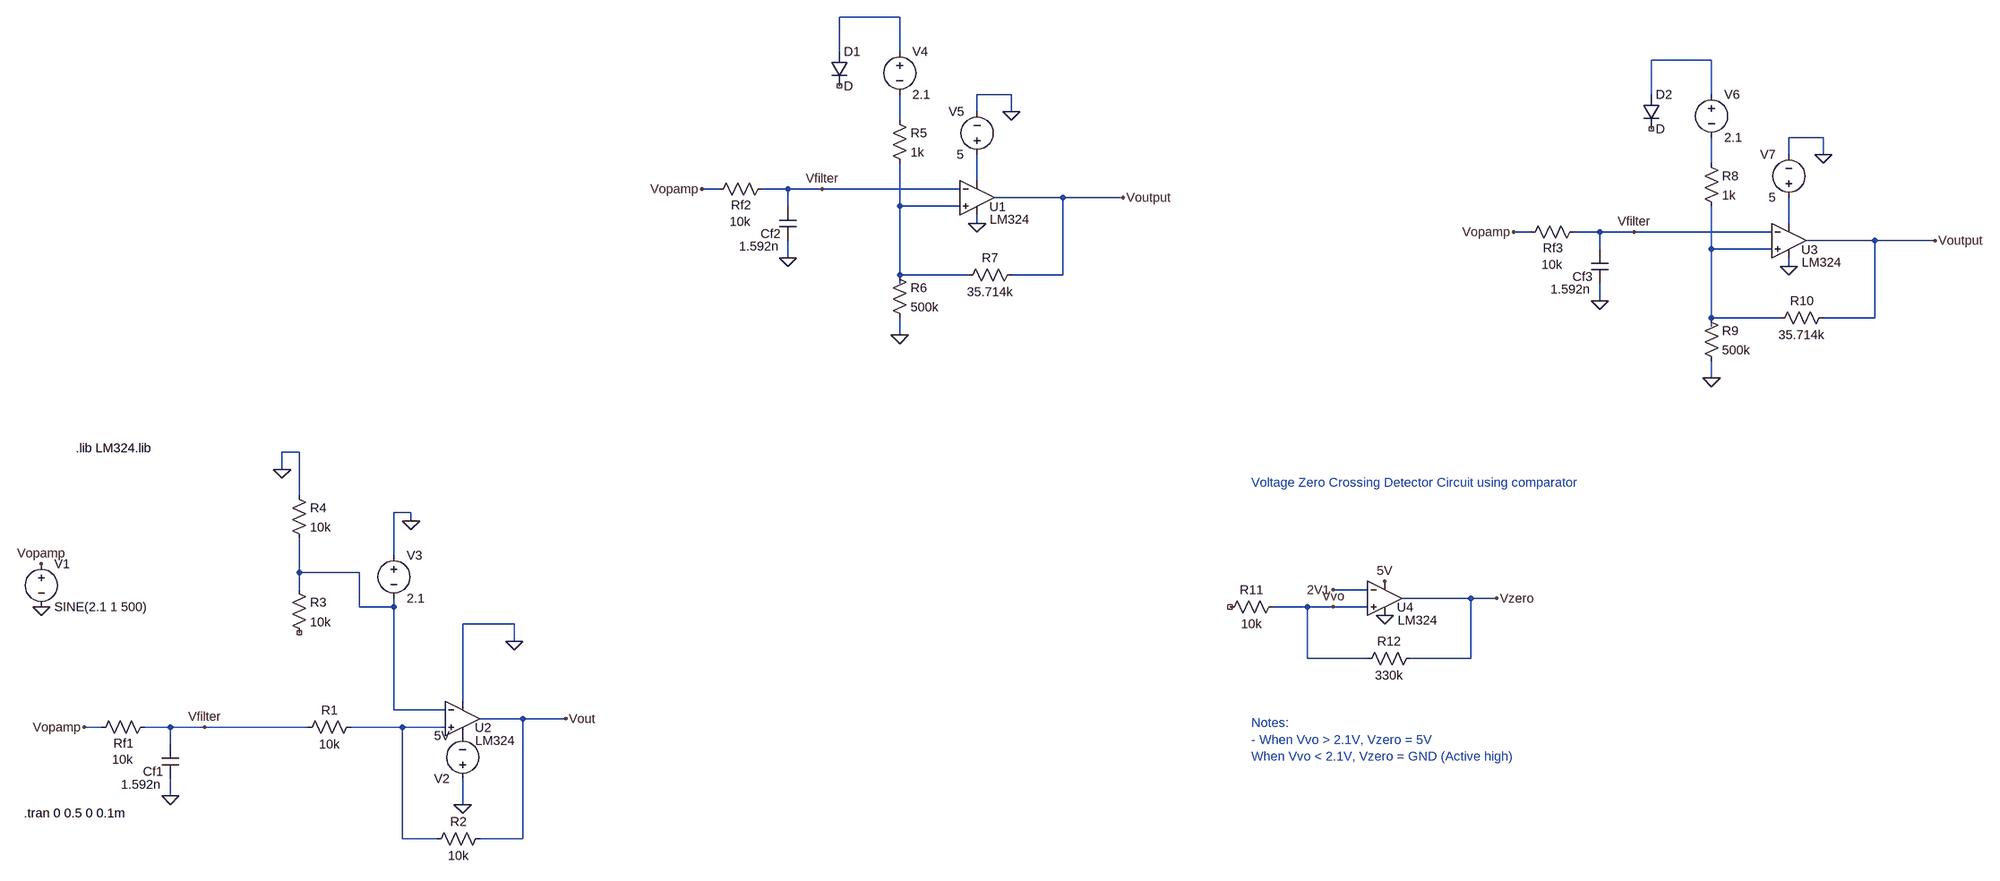
[diagram p0: schematic Comparator.asc]
Comparator.asc, the LTspice schematic file:
Version 4
SHEET 1 4332 680
WIRE 2144 -1360 2032 -1360
WIRE 2032 -1296 2032 -1360
WIRE 2144 -1296 2144 -1360
WIRE 3808 -1280 3696 -1280
WIRE 2352 -1216 2288 -1216
WIRE 3696 -1216 3696 -1280
WIRE 3808 -1216 3808 -1280
WIRE 2288 -1184 2288 -1216
WIRE 2352 -1184 2352 -1216
WIRE 2144 -1168 2144 -1216
WIRE 4016 -1136 3952 -1136
WIRE 3952 -1104 3952 -1136
WIRE 4016 -1104 4016 -1136
WIRE 3808 -1088 3808 -1136
WIRE 2288 -1056 2288 -1104
WIRE 1808 -1040 1776 -1040
WIRE 1936 -1040 1888 -1040
WIRE 2000 -1040 1936 -1040
WIRE 2256 -1040 2000 -1040
WIRE 2448 -1024 2320 -1024
WIRE 2560 -1024 2448 -1024
WIRE 1936 -1008 1936 -1040
WIRE 2144 -1008 2144 -1088
WIRE 2256 -1008 2144 -1008
WIRE 2288 -976 2288 -992
WIRE 3952 -976 3952 -1024
WIRE 3472 -960 3440 -960
WIRE 3600 -960 3552 -960
WIRE 3664 -960 3600 -960
WIRE 3920 -960 3664 -960
WIRE 4112 -944 3984 -944
WIRE 4224 -944 4112 -944
WIRE 3600 -928 3600 -960
WIRE 3808 -928 3808 -1008
WIRE 3920 -928 3808 -928
WIRE 1936 -912 1936 -944
WIRE 3952 -896 3952 -912
WIRE 2144 -880 2144 -1008
WIRE 2272 -880 2144 -880
WIRE 2448 -880 2448 -1024
WIRE 2448 -880 2352 -880
WIRE 2144 -864 2144 -880
WIRE 3600 -832 3600 -864
WIRE 3808 -800 3808 -928
WIRE 3936 -800 3808 -800
WIRE 4112 -800 4112 -944
WIRE 4112 -800 4016 -800
WIRE 3808 -784 3808 -800
WIRE 2144 -768 2144 -800
WIRE 3808 -688 3808 -720
WIRE 560 -448 528 -448
WIRE 528 -416 528 -448
WIRE 560 -368 560 -448
WIRE 768 -336 736 -336
WIRE 768 -320 768 -336
WIRE 736 -256 736 -336
WIRE 560 -224 560 -288
WIRE 672 -224 560 -224
WIRE 560 -192 560 -224
WIRE 3168 -192 3104 -192
WIRE 3360 -176 3232 -176
WIRE 3408 -176 3360 -176
WIRE 672 -160 672 -224
WIRE 736 -160 736 -176
WIRE 736 -160 672 -160
WIRE 3056 -160 2992 -160
WIRE 3104 -160 3056 -160
WIRE 3168 -160 3104 -160
WIRE 960 -128 864 -128
WIRE 960 -96 960 -128
WIRE 3056 -64 3056 -160
WIRE 3168 -64 3056 -64
WIRE 3360 -64 3360 -176
WIRE 3360 -64 3248 -64
WIRE 864 16 864 -128
WIRE 736 32 736 -160
WIRE 832 32 736 32
WIRE 976 48 896 48
WIRE 1056 48 976 48
WIRE 192 64 160 64
WIRE 320 64 272 64
WIRE 384 64 320 64
WIRE 576 64 384 64
WIRE 752 64 656 64
WIRE 832 64 752 64
WIRE 320 96 320 64
WIRE 320 192 320 160
WIRE 864 208 864 160
WIRE 752 272 752 64
WIRE 816 272 752 272
WIRE 976 272 976 48
WIRE 976 272 896 272
FLAG 320 192 0
FLAG 160 64 Vopamp
FLAG 384 64 Vfilter
FLAG 80 -160 0
FLAG 80 -240 Vopamp
FLAG 864 208 0
FLAG 960 -96 0
FLAG 768 -320 0
FLAG 1056 48 Vout
FLAG 528 -416 0
FLAG 1936 -912 0
FLAG 1776 -1040 Vopamp
FLAG 2000 -1040 Vfilter
FLAG 2144 -768 0
FLAG 2288 -976 0
FLAG 2352 -1184 0
FLAG 2560 -1024 Voutput
FLAG 3600 -832 0
FLAG 3440 -960 Vopamp
FLAG 3664 -960 Vfilter
FLAG 3808 -688 0
FLAG 3952 -896 0
FLAG 4016 -1104 0
FLAG 4224 -944 Voutput
FLAG 3200 -208 5V
FLAG 3200 -144 0
FLAG 3408 -176 Vzero
FLAG 3104 -192 2V1
FLAG 3104 -160 Vvo
SYMBOL res 288 48 R90
WINDOW 0 62 55 VBottom 2
WINDOW 3 61 57 VTop 2
SYMATTR InstName Rf1
SYMATTR Value 10k
SYMBOL cap 336 160 R180
WINDOW 0 29 13 Left 2
WINDOW 3 33 -11 Left 2
SYMATTR InstName Cf1
SYMATTR Value 1.592n
SYMBOL voltage 80 -256 R0
WINDOW 39 0 0 Left 0
SYMATTR InstName V1
SYMATTR Value SINE(2.1 1 500)
SYMATTR Value2 AC 1 0
SYMBOL res 672 48 R90
WINDOW 0 0 56 VBottom 2
WINDOW 3 32 56 VTop 2
SYMATTR InstName R1
SYMATTR Value 10k
SYMBOL res 912 256 R90
WINDOW 0 0 56 VBottom 2
WINDOW 3 32 56 VTop 2
SYMATTR InstName R2
SYMATTR Value 10k
SYMBOL voltage 864 176 R180
WINDOW 123 0 0 Left 0
WINDOW 39 0 0 Left 0
SYMATTR InstName V2
SYMATTR Value 5V
SYMBOL voltage 736 -272 R0
WINDOW 123 0 0 Left 0
WINDOW 39 0 0 Left 0
SYMATTR InstName V3
SYMATTR Value 2.1
SYMBOL Opamps/opamp2 864 -16 R0
WINDOW 0 23 81 Left 2
WINDOW 3 24 105 Left 2
SYMATTR InstName U2
SYMATTR Value LM324
SYMBOL res 544 -208 R0
SYMATTR InstName R3
SYMATTR Value 10k
SYMBOL res 544 -384 R0
SYMATTR InstName R4
SYMATTR Value 10k
SYMBOL Opamps/opamp2 2288 -1088 R0
WINDOW 0 23 81 Left 2
WINDOW 3 24 105 Left 2
SYMATTR InstName U1
SYMATTR Value LM324
SYMBOL res 1904 -1056 R90
WINDOW 0 62 55 VBottom 2
WINDOW 3 61 57 VTop 2
SYMATTR InstName Rf2
SYMATTR Value 10k
SYMBOL cap 1952 -944 R180
WINDOW 0 29 13 Left 2
WINDOW 3 33 -11 Left 2
SYMATTR InstName Cf2
SYMATTR Value 1.592n
SYMBOL voltage 2144 -1312 R0
WINDOW 123 0 0 Left 0
WINDOW 39 0 0 Left 0
SYMATTR InstName V4
SYMATTR Value 2.1
SYMBOL diode 2016 -1296 R0
SYMATTR InstName D1
SYMBOL res 2128 -1184 R0
SYMATTR InstName R5
SYMATTR Value 1k
SYMBOL res 2128 -896 R0
SYMATTR InstName R6
SYMATTR Value 500k
SYMBOL res 2368 -896 R90
WINDOW 0 0 56 VBottom 2
WINDOW 3 32 56 VTop 2
SYMATTR InstName R7
SYMATTR Value 35.714k
SYMBOL voltage 2288 -1088 R180
WINDOW 0 24 96 Left 2
WINDOW 3 24 16 Left 2
WINDOW 123 0 0 Left 0
WINDOW 39 0 0 Left 0
SYMATTR InstName V5
SYMATTR Value 5
SYMBOL Opamps/opamp2 3952 -1008 R0
WINDOW 0 23 81 Left 2
WINDOW 3 24 105 Left 2
SYMATTR InstName U3
SYMATTR Value LM324
SYMBOL res 3568 -976 R90
WINDOW 0 62 55 VBottom 2
WINDOW 3 61 57 VTop 2
SYMATTR InstName Rf3
SYMATTR Value 10k
SYMBOL cap 3616 -864 R180
WINDOW 0 29 13 Left 2
WINDOW 3 33 -11 Left 2
SYMATTR InstName Cf3
SYMATTR Value 1.592n
SYMBOL voltage 3808 -1232 R0
WINDOW 123 0 0 Left 0
WINDOW 39 0 0 Left 0
SYMATTR InstName V6
SYMATTR Value 2.1
SYMBOL diode 3680 -1216 R0
SYMATTR InstName D2
SYMBOL res 3792 -1104 R0
SYMATTR InstName R8
SYMATTR Value 1k
SYMBOL res 3792 -816 R0
SYMATTR InstName R9
SYMATTR Value 500k
SYMBOL res 4032 -816 R90
WINDOW 0 0 56 VBottom 2
WINDOW 3 32 56 VTop 2
SYMATTR InstName R10
SYMATTR Value 35.714k
SYMBOL voltage 3952 -1008 R180
WINDOW 0 24 96 Left 2
WINDOW 3 24 16 Left 2
WINDOW 123 0 0 Left 0
WINDOW 39 0 0 Left 0
SYMATTR InstName V7
SYMATTR Value 5
SYMBOL Opamps/opamp2 3200 -240 R0
WINDOW 0 23 81 Left 2
WINDOW 3 24 105 Left 2
SYMATTR InstName U4
SYMATTR Value LM324
SYMBOL res 3008 -176 R90
WINDOW 0 0 56 VBottom 2
WINDOW 3 32 56 VTop 2
SYMATTR InstName R11
SYMATTR Value 10k
SYMBOL res 3264 -80 R90
WINDOW 0 0 56 VBottom 2
WINDOW 3 32 56 VTop 2
SYMATTR InstName R12
SYMATTR Value 330k
TEXT 48 224 Left 2 !.tran 0 0.5 0 0.1m
TEXT 144 -456 Left 2 !.lib LM324.lib
TEXT 2952 -392 Left 2 ;Voltage Zero Crossing Detector Circuit using comparator
TEXT 2952 56 Left 2 ;Notes:\n- When Vvo > 2.1V, Vzero = 5V\nWhen Vvo < 2.1V, Vzero = GND (Active high)

The netlist it stands for:
* Comparator.asc
Rf1 Vfilter Vopamp 10k
Cf1 0 Vfilter 1.592n
V1 Vopamp 0 SINE(2.1 1 500) AC 1 0
R1 N010 Vfilter 10k
R2 Vout N010 10k
V2 0 P001 5V
V3 0 N009 2.1
XU2 N010 N009 0 P001 Vout LM324  ; pins In+ In- V+ V- OUT
R3 N009 NC_01 10k
R4 0 N009 10k
XU1 N006 Vfilter N005 0 Voutput LM324  ; pins In+ In- V+ V- OUT
Rf2 Vfilter Vopamp 10k
Cf2 0 Vfilter 1.592n
V4 N001 N003 2.1
D1 N001 NC_02 D
R5 N003 N006 1k
R6 N006 0 500k
R7 Voutput N006 35.714k
V5 N005 0 5
XU3 N008 Vfilter N007 0 Voutput LM324  ; pins In+ In- V+ V- OUT
Rf3 Vfilter Vopamp 10k
Cf3 0 Vfilter 1.592n
V6 N002 N004 2.1
D2 N002 NC_03 D
R8 N004 N008 1k
R9 N008 0 500k
R10 Voutput N008 35.714k
V7 N007 0 5
XU4 Vvo 2V1 5V 0 Vzero LM324  ; pins In+ In- V+ V- OUT
R11 Vvo NC_04 10k
R12 Vzero Vvo 330k
.model D D
.lib standard.dio
.tran 0 0.5 0 0.1m
.lib LM324.lib
* Voltage Zero Crossing Detector Circuit using comparator
* Notes:
* - When Vvo > 2.1V, Vzero = 5V
* When Vvo < 2.1V, Vzero = GND (Active high)
.backanno
.end